# Altium schematic sheet APPS.SchDoc
size A4; SheetNumber: 4; SheetTotal: 6
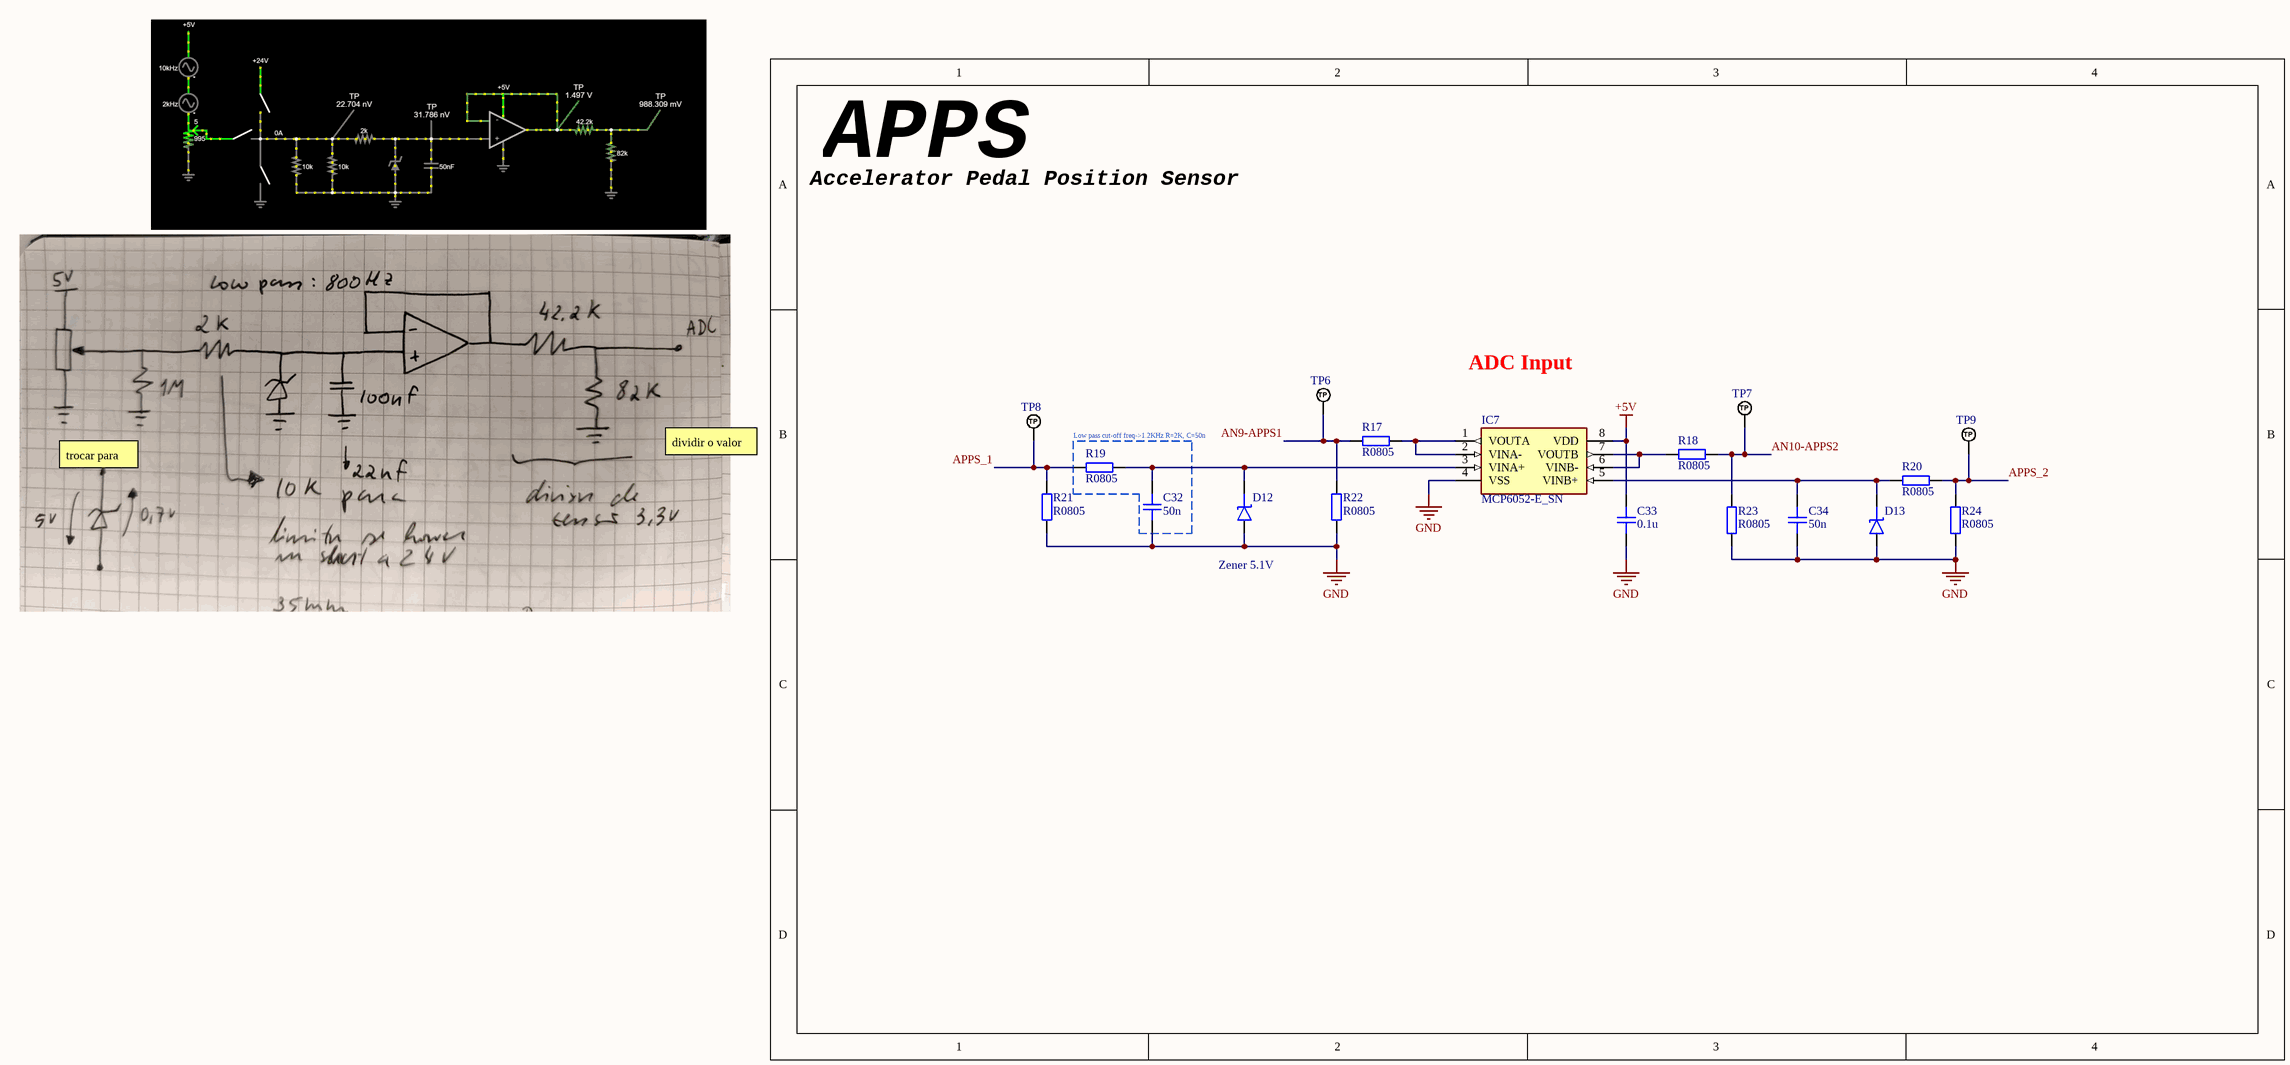
[diagram p0: APPS.SchDoc]

## Parts
C32  50n  [CAP_0805]
C33  0.1u  [CAP_0805]
C34  50n  [CAP_0805]
D12  D_SCHOTTKY_SOD_323  [SOD-323]  (value not drawn)
D13  D_SCHOTTKY_SOD_323  [SOD-323]  (value not drawn)
IC7  MCP6052-E_SN  [SOIC127P600X175-8N]
R17  R0805  [RES_0805]
R18  R0805  [RES_0805]
R19  R0805  [RES_0805]
R20  R0805  [RES_0805]
R21  R0805  [RES_0805]
R22  R0805  [RES_0805]
R23  R0805  [RES_0805]
R24  R0805  [RES_0805]
TP6  TP_NOBOM  [PAD_RND_1MM]  (value not drawn)  (no BOM)
TP7  TP_NOBOM  [PAD_RND_1MM]  (value not drawn)  (no BOM)
TP8  TP_NOBOM  [PAD_RND_1MM]  (value not drawn)  (no BOM)
TP9  TP_NOBOM  [PAD_RND_1MM]  (value not drawn)  (no BOM)

## Blocks framed on the sheet
Low pass cut-off freq->1.2KHz R=2K, C=50n: C32 R19

## Nets
+5V: C33.2 IC7.8(VDD)
GND: C32.2 C33.1 C34.2 D12.A D13.A IC7.4(VSS) R21.1 R22.2 R23.2 R24.1
AN9-APPS1: R17.2 R22.1 TP6.1(TP)
AN10-APPS2: R18.1 R23.1 TP7.1(TP)
APPS_1: R19.1 R21.2 TP8.1(TP)
APPS_2: R20.2 R24.2 TP9.1(TP)
NetC32_1: C32.1 D12.K IC7.3(VINA+) R19.2
NetC34_1: C34.1 D13.K IC7.5(VINB+) R20.1
NetIC7_1: IC7.1(VOUTA) IC7.2(VINA-) R17.1
NetIC7_6: IC7.6(VINB-) IC7.7(VOUTB) R18.2

## Notes on the sheet
- Accelerator Pedal Position Sensor
- APPS
- ADC Input
- trocar para 100k
- dividir o valor das resistencias por 10
- (near D12) Zener 5.1V

## Library data of the parts
C32-C34 = CAP_0805_10V: Capacitor SMD 0805 10V
D12 D13 = D_SCHOTTKY_SOD_323: Diode Schottky SMD SOD-323
IC7 = MCP6052-E_SN: Integrated Circuit; Manufacturer_Name: Microchip; Manufacturer_Part_Number: MCP6052-E/SN; Datasheet Link: http://ww1.microchip.com/downloads/en/DeviceDoc/MCP6051_DS22182B.pdf; Height: 1.75mm; Mouser Part Number: 579-MCP6052-E/SN; Mouser Price/Stock: https://www.mouser.com/Search/Refine.aspx?Keyword=579-MCP6052-E%2FSN
R17-R24 = RES_0805: Resistor SMD 0805; Manufacturer: *; Manufacturer Part Number: *; Distributor Link: *; LCSC: *
TP6-TP9 = TEST_POINT_RND_1MM: Test Point Round 1mm (NO BOM)